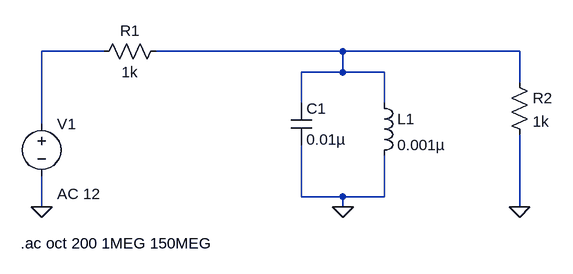
[diagram p0: schematic Pass-Band Filter.asc]
Pass-Band Filter.asc, the LTspice schematic file:
Version 4
SHEET 1 1380 680
WIRE 176 32 80 32
WIRE 544 32 256 32
WIRE 816 32 544 32
WIRE 544 64 544 32
WIRE 544 64 480 64
WIRE 608 64 544 64
WIRE 816 80 816 32
WIRE 480 112 480 64
WIRE 608 112 608 64
WIRE 80 144 80 32
WIRE 480 256 480 176
WIRE 544 256 480 256
WIRE 608 256 608 192
WIRE 608 256 544 256
WIRE 80 272 80 224
WIRE 544 272 544 256
WIRE 816 272 816 160
FLAG 80 272 0
FLAG 544 272 0
FLAG 816 272 0
SYMBOL voltage 80 128 R0
WINDOW 123 24 124 Left 2
WINDOW 39 0 0 Left 0
SYMATTR Value2 AC 12
SYMATTR InstName V1
SYMATTR Value ""
SYMBOL res 272 16 R90
WINDOW 0 0 56 VBottom 2
WINDOW 3 32 56 VTop 2
SYMATTR InstName R1
SYMATTR Value 1k
SYMBOL cap 464 112 R0
SYMATTR InstName C1
SYMATTR Value 0.01µ
SYMBOL ind 592 96 R0
SYMATTR InstName L1
SYMATTR Value 0.001µ
SYMBOL res 800 64 R0
SYMATTR InstName R2
SYMATTR Value 1k
TEXT 48 328 Left 2 !.ac oct 200 1MEG 150MEG

The netlist it stands for:
* Pass-Band Filter.asc
V1 N001 0 AC 12
R1 N002 N001 1k
C1 N002 0 0.01µ
L1 N002 0 0.001µ
R2 N002 0 1k
.ac oct 200 1MEG 150MEG
.backanno
.end